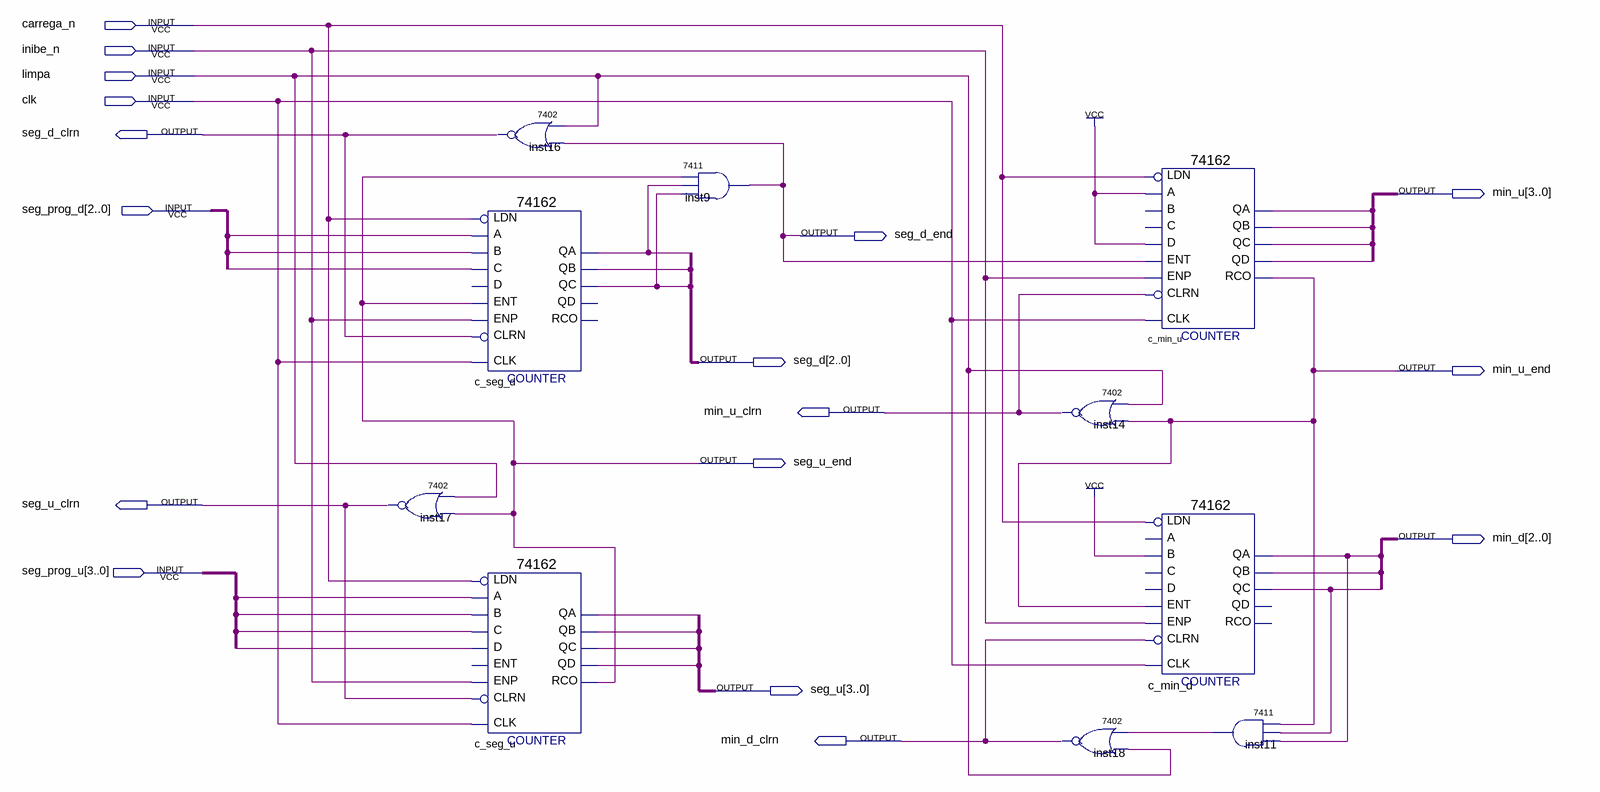
[diagram p0: schematic sheet]
// Quartus schematic fluxo_dados.bdf as structural Verilog: 10 symbols, 17 pins
module fluxo_dados (
  input  carrega_n,
  input  inibe_n,
  input  limpa,
  input  clk,
  input  [2:0] seg_prog_d,
  input  [3:0] seg_prog_u,
  output seg_d_clrn,
  output [3:0] min_u,
  output seg_d_end,
  output [2:0] seg_d,
  output min_u_end,
  output min_u_clrn,
  output seg_u_end,
  output seg_u_clrn,
  output [2:0] min_d,
  output [3:0] seg_u,
  output min_d_clrn
);

  wire inst11_1;

  \7402  inst17 (.\2 (limpa), .\3 (seg_u_end), .\1 (seg_u_clrn));
  \7402  inst16 (.\2 (limpa), .\3 (seg_d_end), .\1 (seg_d_clrn));
  \74162  c_seg_d (
    .A(seg_prog_d[0]), .LDN(carrega_n), .B(seg_prog_d[1]), .C(seg_prog_d[2]), .ENP(inibe_n), .ENT(seg_u_end),
    .CLRN(seg_d_clrn), .CLK(clk), .QA(seg_d[0]), .QB(seg_d[1]), .QC(seg_d[2]));  // open: D, QD, RCO
  \74162  c_seg_u (
    .A(seg_prog_u[0]), .LDN(carrega_n), .B(seg_prog_u[1]), .C(seg_prog_u[2]), .D(seg_prog_u[3]),
    .ENP(inibe_n), .CLRN(seg_u_clrn), .CLK(clk), .QA(seg_u[0]), .QB(seg_u[1]), .QC(seg_u[2]), .QD(seg_u[3]),
    .RCO(seg_u_end));  // open: ENT
  \7411  inst9 (.\2 (seg_u_end), .\3 (seg_d[0]), .\4 (seg_d[2]), .\1 (seg_d_end));
  \7402  inst14 (.\2 (limpa), .\3 (min_u_end), .\1 (min_u_clrn));
  \7402  inst18 (.\2 (inst11_1), .\3 (limpa), .\1 (min_d_clrn));
  \74162  c_min_u (
    .A(1'b1), .LDN(carrega_n), .D(1'b1), .ENP(inibe_n), .ENT(seg_d_end), .CLRN(min_u_clrn), .CLK(clk),
    .QA(min_u[0]), .QB(min_u[1]), .QC(min_u[2]), .QD(min_u[3]), .RCO(min_u_end));  // open: B, C
  \74162  c_min_d (
    .LDN(carrega_n), .B(1'b1), .ENP(inibe_n), .ENT(min_u_end), .CLRN(min_d_clrn), .CLK(clk), .QA(min_d[0]),
    .QB(min_d[1]), .QC(min_d[2]));  // open: A, C, D, QD, RCO
  \7411  inst11 (.\2 (min_u_end), .\3 (min_d[2]), .\4 (min_d[0]), .\1 (inst11_1));
endmodule
